# Altium project BAI_TAP_LON.PrjPcb
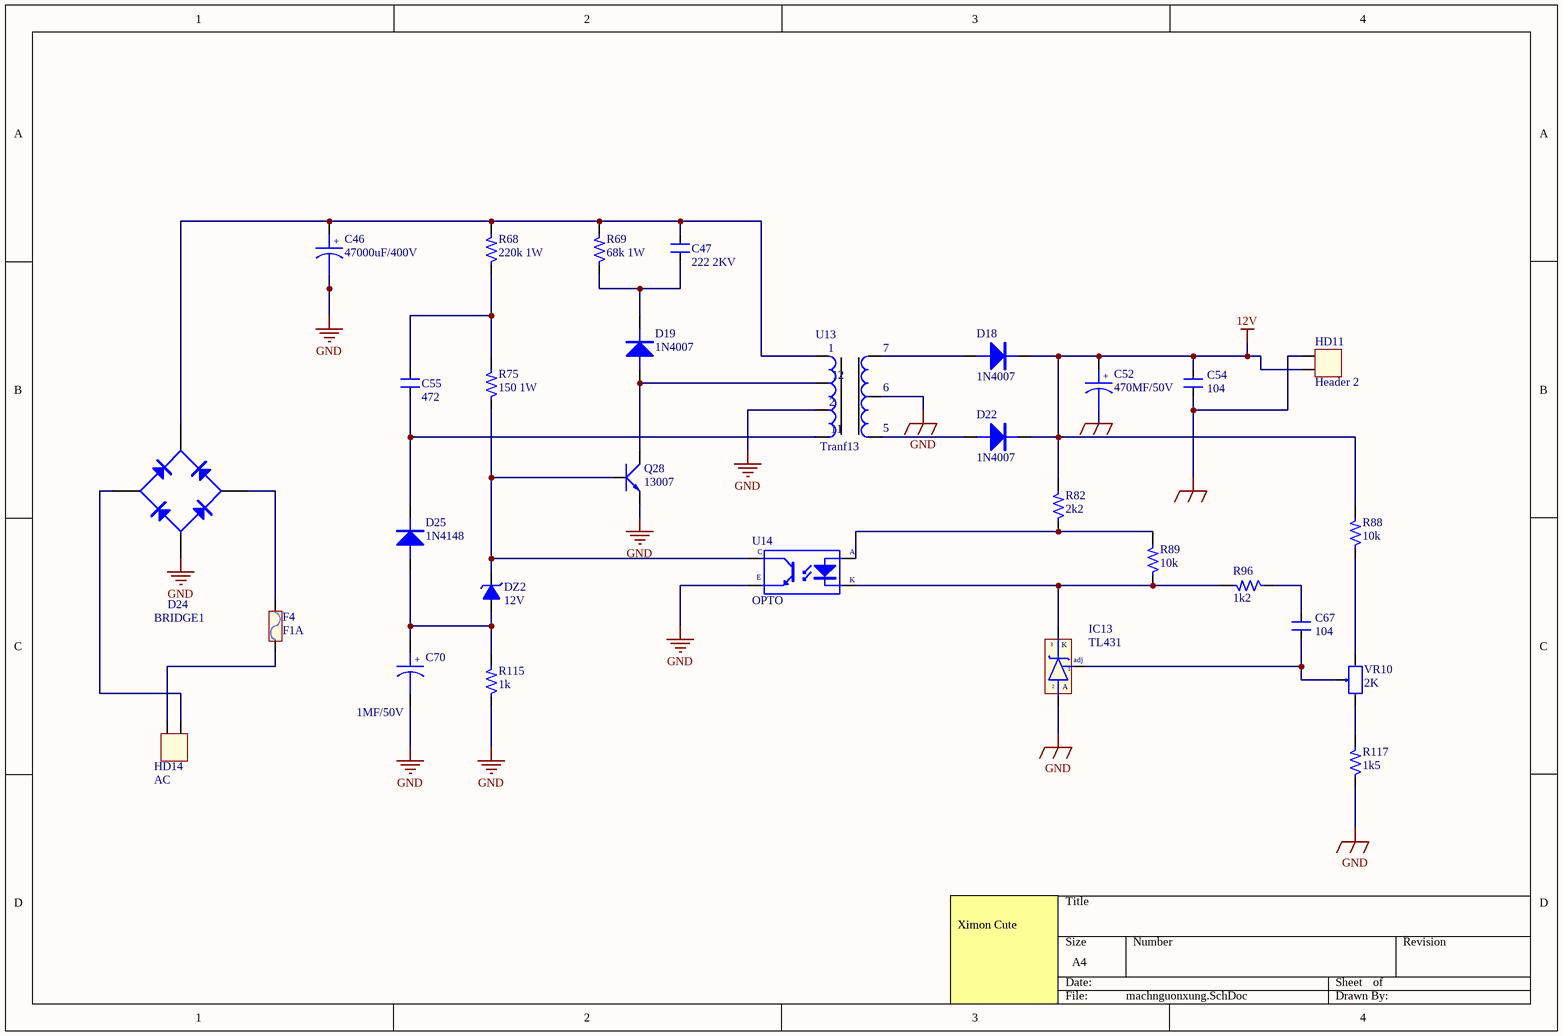
[diagram p0: machnguonxung.SchDoc]
1 sheet, 30 parts. Net scope: global (net labels, ports and power ports of the same name join across sheets).
Board file: machnguonxung.PcbDoc

## Sheet machnguonxung.SchDoc
size A4; SheetNumber: 1; SheetTotal: 1

### Parts
C46  47000uF/400V  [CAP10UF]
C47  222 2KV  [SM-0805]
C52  470MF/50V  [CAP10UF]
C54  104  [SM-0805]
C55  472  [SM-0805]
C67  104  [SM-0805]
C70  CAPACI  [CAP10UF]  (value not drawn)
D18  1N4007  [diode]
D19  1N4007  [diode]
D22  1N4007  [diode]
D24  BRIDGE1  [BRIDGE_DAN]
D25  1N4148  [diode]
DZ2  12V  [D1A]
F4  F1A  [Fuse]
HD11  Header 2  [HED2]
HD14  AC  [HED2]
IC13  TL431  [qto-92]
Q28  13007  [QTO-220]
R68  220k 1W  [R1/6W]
R69  68k 1W  [R1/6W]
R75  150 1W  [R1/6W]
R82  2k2  [R1/6W]
R88  10k  [R1/6W]
R89  10k  [R1/6W]
R96  1k2  [R1/6W]
R115  1k  [R1/6W]
R117  1k5  [R1/6W]
U13  Tranf13  [BAX_EE32]
U14  OPTO  [OPTO_U]
VR10  2K  [VR]

### Nets
12V: C52.1 C54.2 D18.2 D22.2 HD11.2 R82.2 R88.2
GND: C46.2 C52.2 C54.1 C70.2 D24.4(V-) HD11.1 IC13.2(A) Q28.3(E) R115.1 R117.1 U13.3 U13.10 U14.E
NetC46_1: C46.1 C47.2 D24.1(V+) R68.2 R69.2 U13.12
NetC47_1: C47.1 D19.2 R69.1
NetC55_1: C55.1 D25.2 U13.9
NetC55_2: C55.2 R68.1 R75.2
NetC67_1: C67.1 IC13.1(adj) VR10.2
NetC67_2: C67.2 R96.1
NetC70_1: C70.1 D25.1 DZ2.1(A) R115.2
NetD18_1: D18.1 U13.1
NetD19_1: D19.1 Q28.2(C) U13.11
NetD22_1: D22.1 U13.6
NetD24_2: D24.2(AC) HD14.1
NetD24_3: D24.3(AC) F4.2
NetDZ2_2: DZ2.2(K) Q28.1(B) R75.1 U14.C
NetF4_1: F4.1 HD14.2
NetIC13_3: IC13.3(K) R89.1 R96.2 U14.K
NetR82_1: R82.1 R89.2 U14.A
NetR88_1: R88.1 VR10.3
NetR117_2: R117.2 VR10.1

### Notes on the sheet
- (near C70) 1MF/50V
- Ximon Cute
- (in symbol BAX_EE32) 7; 2; 5
- (in symbol CAPACITOR POL) +

### Library data of the parts
C46 C52 C70 = CAPACITOR POL: Capacitor
C47 C54 C55 C67 = CM: Cap SMD; Value: 103
D18 D19 D22 D25 = DIODE
D24 = BRIDGE1: Diode Bridge
DZ2 = Diode Zener: Diode  Zener
F4 = Fuse: Designed by: VanDungEvn; Value: Fuse
HD11 HD14 = Hed2: Header 2 (Green); Value: Header 2
IC13 = TL431: Programmable Shunt Regulator; Value: TL431
Q28 = NPN_BCE: P 1W, BCE; Value: TIP41
R68 R69 R75 R82 R88 R89 R96 R115 R117 = Res: Resistor 1/4W; Value: R1/4W - 1K
U13 = BAX_EE32: Tranformer; Value: BA xung
U14 = OPTO_U: Single Opto; Value: TLP5211
VR10 = VR: Var Resistor; Value: VR 10K